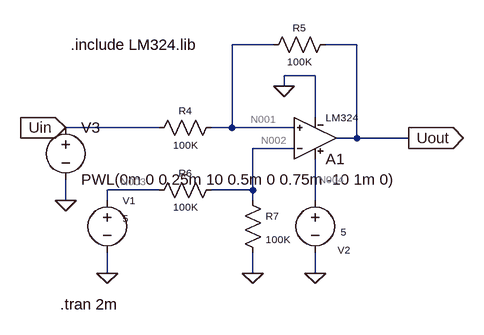
[diagram p0: schematic lab2_g.asc]
lab2_g.asc, the LTspice schematic file:
Version 4.1
SHEET 1 880 680
WIRE 48 0 -16 0
WIRE 176 0 128 0
WIRE 112 48 64 48
WIRE 64 64 64 48
WIRE 112 112 112 48
WIRE -128 128 -272 128
WIRE -16 128 -16 0
WIRE -16 128 -48 128
WIRE 80 128 -16 128
WIRE 176 144 176 0
WIRE 176 144 144 144
WIRE 256 144 176 144
WIRE 80 160 16 160
WIRE -128 224 -208 224
WIRE 16 224 16 160
WIRE 16 224 -48 224
WIRE -272 240 -272 208
WIRE -208 240 -208 224
WIRE 16 240 16 224
WIRE 112 240 112 176
WIRE -208 352 -208 320
WIRE 16 352 16 320
WIRE 112 352 112 320
FLAG 64 64 0
FLAG -208 352 0
FLAG 256 144 Uout
IOPIN 256 144 Out
FLAG 16 352 0
FLAG 112 352 0
FLAG -272 240 0
FLAG -272 128 Uin
IOPIN -272 128 In
SYMBOL LM324 112 144 M180
WINDOW 3 16 32 Left 1
SYMATTR InstName A1
SYMBOL voltage 112 224 R0
WINDOW 0 44 82 Top 1
WINDOW 3 44 54 Top 1
WINDOW 123 0 0 Left 0
WINDOW 39 0 0 Left 0
SYMATTR InstName V2
SYMATTR Value 5
SYMBOL res 144 -16 R90
WINDOW 0 0 56 VBottom 1
WINDOW 3 32 56 VTop 1
SYMATTR InstName R5
SYMATTR Value 100K
SYMATTR SpiceLine tol=1 pwr=0.1
SYMBOL res -32 112 R90
WINDOW 0 0 56 VBottom 1
WINDOW 3 32 56 VTop 1
SYMATTR InstName R4
SYMATTR Value 100K
SYMATTR SpiceLine tol=1 pwr=0.1
SYMBOL res -32 208 R90
WINDOW 0 0 56 VBottom 1
WINDOW 3 32 56 VTop 1
SYMATTR InstName R6
SYMATTR Value 100K
SYMATTR SpiceLine tol=1 pwr=0.1
SYMBOL voltage -208 224 R0
WINDOW 0 24 16 Left 1
WINDOW 3 24 44 Left 1
WINDOW 123 0 0 Left 0
WINDOW 39 0 0 Left 0
SYMATTR InstName V1
SYMATTR Value 5
SYMBOL res 0 224 R0
WINDOW 0 36 40 Left 1
WINDOW 3 36 76 Left 1
SYMATTR InstName R7
SYMATTR Value 100K
SYMATTR SpiceLine tol=1 pwr=0.1
SYMBOL voltage -272 112 R0
WINDOW 123 0 0 Left 0
WINDOW 39 0 0 Left 0
SYMATTR InstName V3
SYMATTR Value PWL(0m 0 0.25m 10 0.5m 0 0.75m -10 1m 0)
TEXT -280 400 Left 2 !.tran 2m
TEXT -264 0 Left 2 !.include LM324.lib

The netlist it stands for:
* lab2_g.asc
X§A1 N001 N002 N004 0 Uout LM324  ; pins In+ In- V+ V- OUT
V2 N004 0 5
R5 Uout N001 100K tol=1 pwr=0.1
R4 N001 Uin 100K tol=1 pwr=0.1
R6 N002 N003 100K tol=1 pwr=0.1
V1 N003 0 5
R7 N002 0 100K tol=1 pwr=0.1
V3 Uin 0 PWL(0m 0 0.25m 10 0.5m 0 0.75m -10 1m 0)
.tran 2m
.include LM324.lib
.backanno
.end

* Results of the author's LTspice run, read from the files saved beside the schematic
* Operating Point, zero values left out:
*   V(n002) = 2.501 V
*   V(uout) = 329.4 µV
*   V(n001) = 4.359 mV
*   V(n004) = 5 V
*   V(n003) = 5 V
*   I(R5) = -40.3 nA
*   I(R6) = -24.99 µA
*   I(V1) = -24.99 µA
*   I(V3) = 43.59 nA
*   I(R4) = 43.59 nA
*   I(R7) = 25.01 µA
*   I(V2) = -307.4 µA
*   Ix(a1:in+) = -83.89 nA
*   Ix(a1:in-) = -26.53 nA
*   Ix(a1:vcc) = 307.4 µA
*   Ix(a1:vss) = -307.4 µA
*   Ix(a1:out) = 40.3 nA
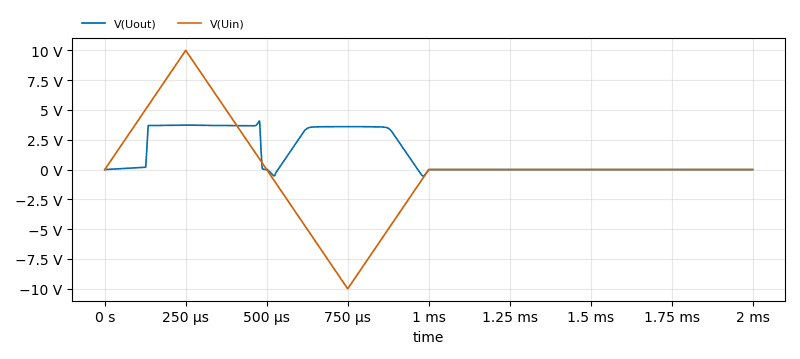
[diagram p1: Transient Analysis of lab2_g.asc, plotted from the saved traces]
* Transient Analysis, 1 run:
*   V(Uout): min -534.6 mV, max 4.077 V, average 1.262 V, rms 2.118 V, last 337.1 µV
*   V(Uin): min -10 V, max 10 V, average 0 V, rms 4.147 V, last 0 V